# Altium schematic sheet Controller_PCB_LED.SchDoc
size A4
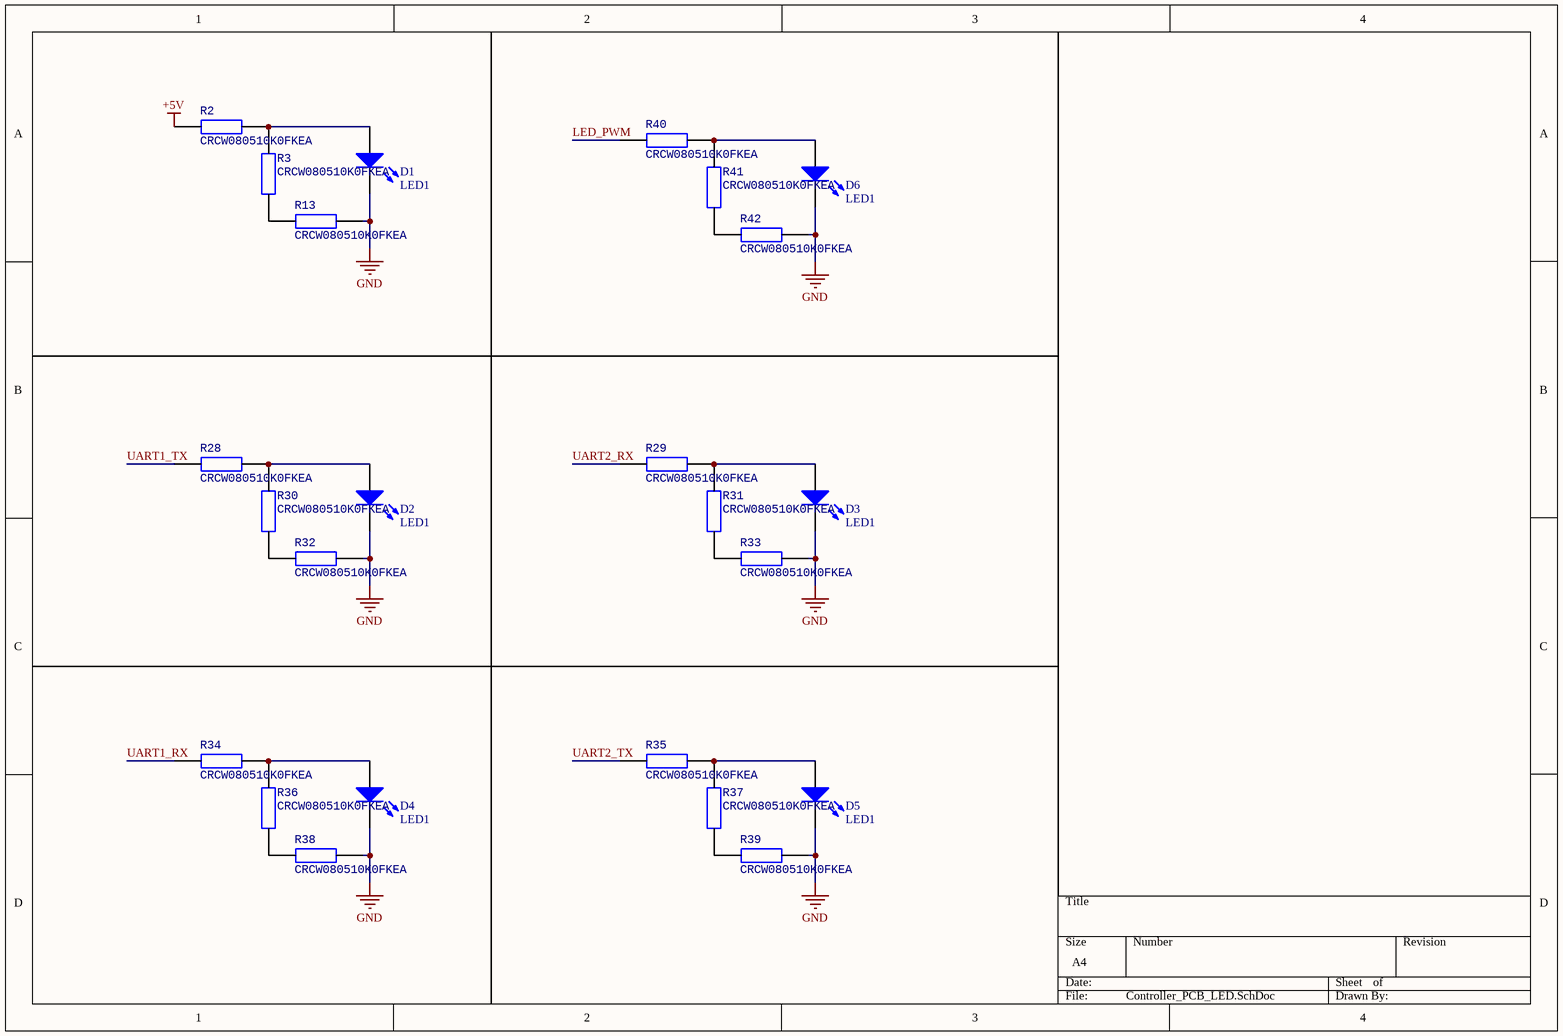
[diagram p0: Controller_PCB_LED.SchDoc]

## Parts
D1  LED1  [L0603]
D2  LED1  [L0603]
D3  LED1  [L0603]
D4  LED1  [L0603]
D5  LED1  [L0603]
D6  LED1  [L0603]
R2  CRCW080510K0FKEA  [RESC2012X50N]
R3  CRCW080510K0FKEA  [RESC2012X50N]
R13  CRCW080510K0FKEA  [RESC2012X50N]
R28  CRCW080510K0FKEA  [RESC2012X50N]
R29  CRCW080510K0FKEA  [RESC2012X50N]
R30  CRCW080510K0FKEA  [RESC2012X50N]
R31  CRCW080510K0FKEA  [RESC2012X50N]
R32  CRCW080510K0FKEA  [RESC2012X50N]
R33  CRCW080510K0FKEA  [RESC2012X50N]
R34  CRCW080510K0FKEA  [RESC2012X50N]
R35  CRCW080510K0FKEA  [RESC2012X50N]
R36  CRCW080510K0FKEA  [RESC2012X50N]
R37  CRCW080510K0FKEA  [RESC2012X50N]
R38  CRCW080510K0FKEA  [RESC2012X50N]
R39  CRCW080510K0FKEA  [RESC2012X50N]
R40  CRCW080510K0FKEA  [RESC2012X50N]
R41  CRCW080510K0FKEA  [RESC2012X50N]
R42  CRCW080510K0FKEA  [RESC2012X50N]

## Nets
+5V: R2.1
GND: D1.2(K) D2.2(K) D3.2(K) D4.2(K) D5.2(K) D6.2(K) R13.1 R32.1 R33.1 R38.1 R39.1 R42.1
LED_PWM: R40.1
UART1_RX: R34.1
UART1_TX: R28.1
UART2_RX: R29.1
UART2_TX: R35.1
NetD1_1: D1.1(A) R2.2 R3.2
NetD2_1: D2.1(A) R28.2 R30.2
NetD3_1: D3.1(A) R29.2 R31.2
NetD4_1: D4.1(A) R34.2 R36.2
NetD5_1: D5.1(A) R35.2 R37.2
NetD6_1: D6.1(A) R40.2 R41.2
NetR3_1: R3.1 R13.2
NetR30_1: R30.1 R32.2
NetR31_1: R31.1 R33.2
NetR36_1: R36.1 R38.2
NetR37_1: R37.1 R39.2
NetR41_1: R41.1 R42.2

## Library data of the parts
D1-D6 = LED1: Typical RED GaAs LED; Published: 8-Jun-2000; LatestRevisionDate: 08-Jul-2005; LatestRevisionNote: Mech Layer 1 removed.; PackageReference: LED-1; Publisher: Altium Limited; PackageDescription: LED; 2 Leads
R2 R3 R13 R28-R42 = CRCW080510K0FKEA: CRCW0805 Resistor T/R 0.125W,1%,10K Vishay CRCW Series Thick Film Surface Mount Resistor 0805 Case 10k 1% 0.125W 100ppm/C; Allied_Number: 70203987; Geometry.Height: 0.5mm; RS Part Number: 1694499; Manufacturer_Name: Vishay; Manufacturer_Part_Number: CRCW080510K0FKEA; Datasheet Link: http://uk.rs-online.com/web/p/products/1694499